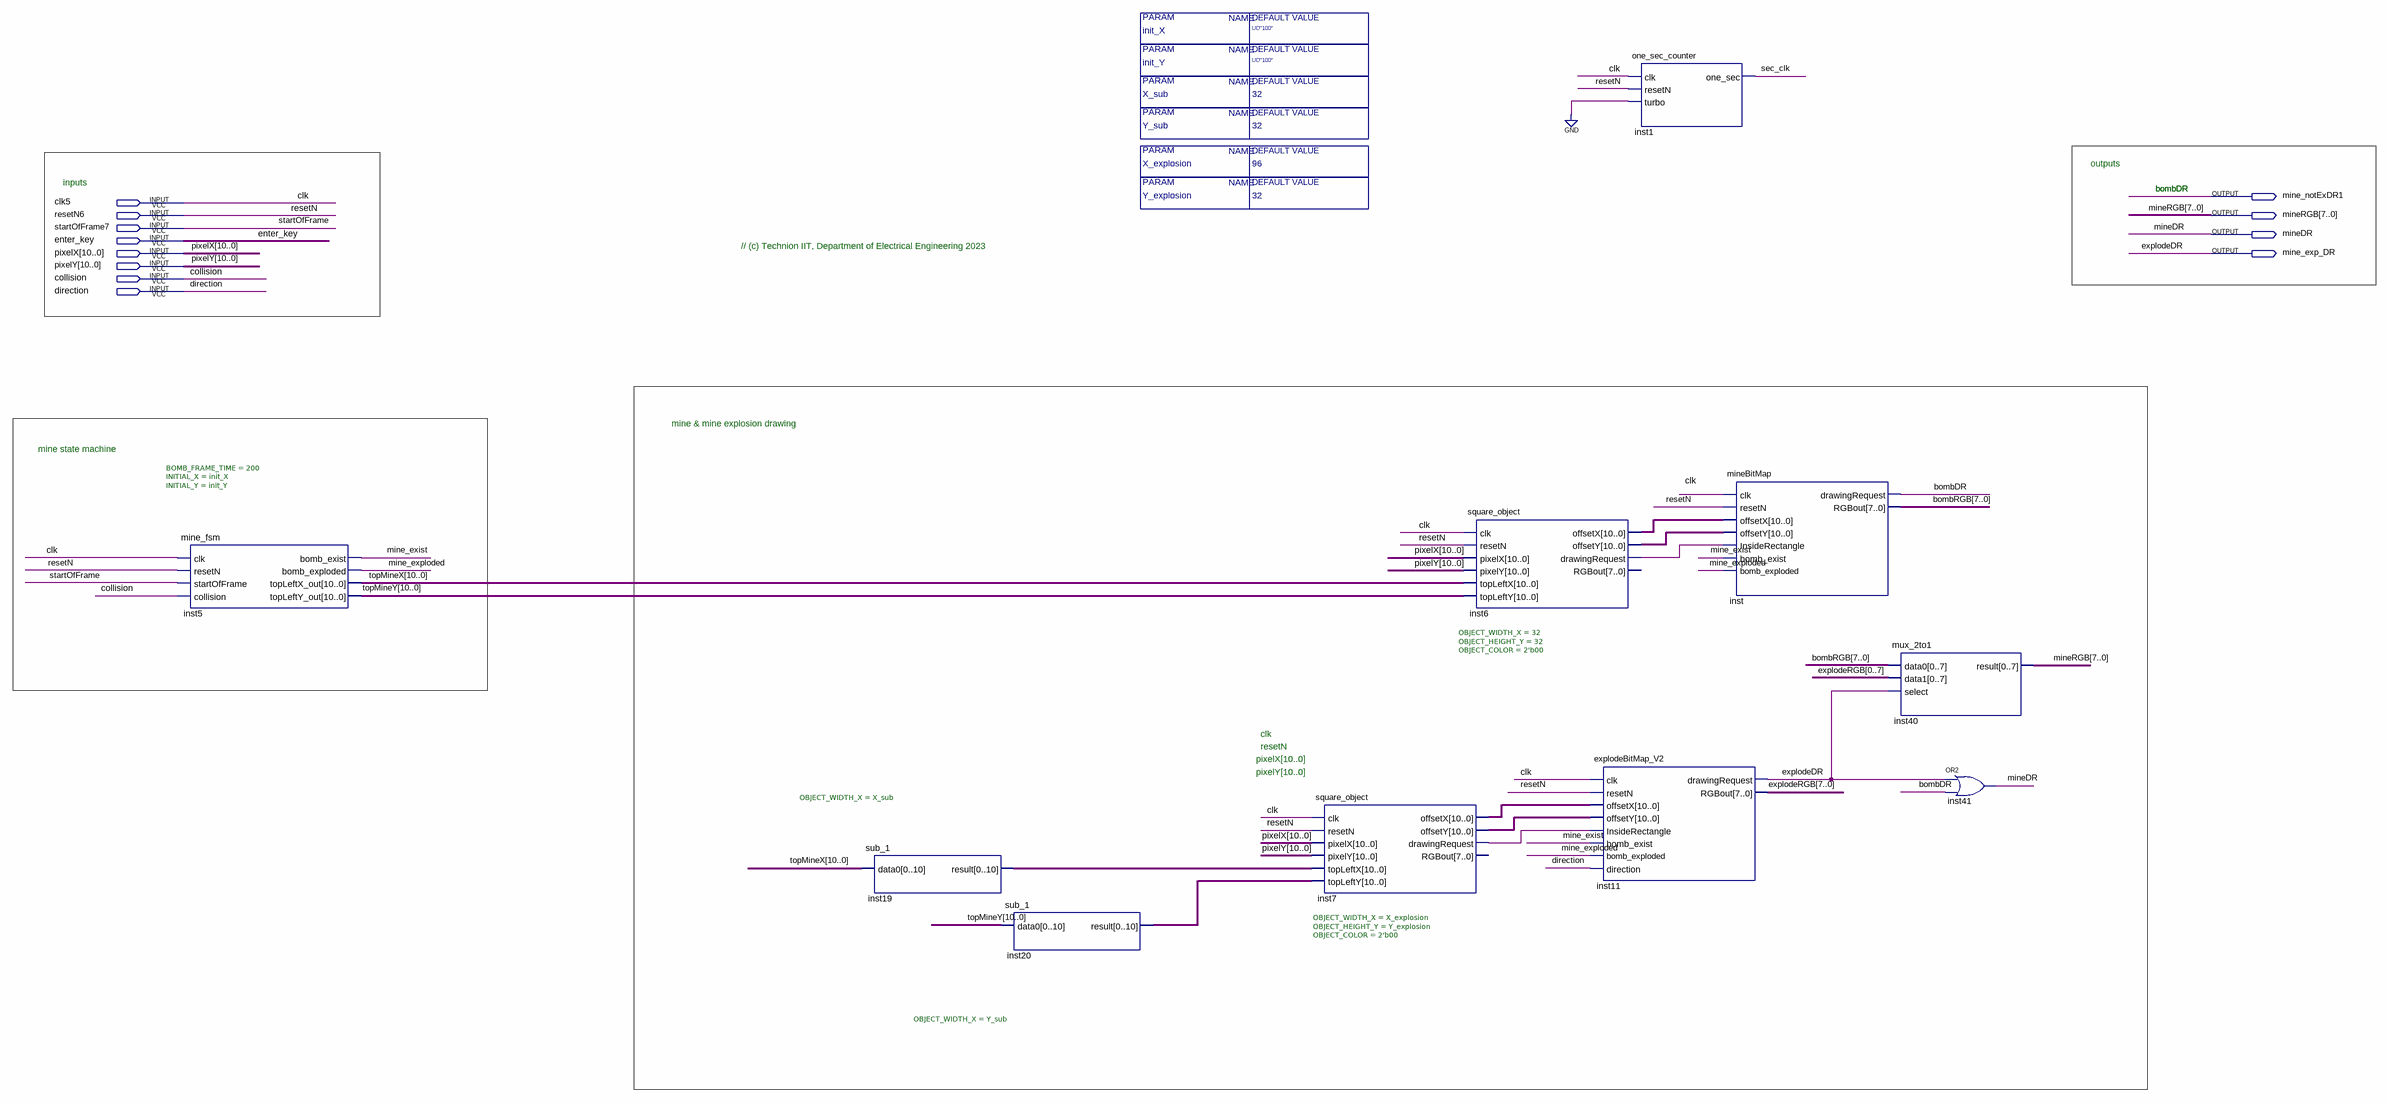
[diagram p0: schematic sheet]
// Quartus schematic mine_Block_T.bdf as structural Verilog: 10 symbols, 12 pins
module mine_Block_T #(parameter init_X = "UD\"100\"", parameter init_Y = "UD\"100\"", parameter X_explosion = 96, parameter Y_explosion = 32, parameter X_sub = 32, parameter Y_sub = 32) (
  input  clk5,
  input  resetN6,
  input  startOfFrame7,
  input  enter_key,
  input  [10:0] pixelX,
  input  [10:0] pixelY,
  input  collision,
  input  direction,
  output mine_notExDR1,
  output [7:0] mineRGB,
  output mineDR,
  output mine_exp_DR
);

  wire inst6_drawingrequest, inst7_drawingrequest, mine_exist, mine_exploded, sec_clk;
  wire [7:0] bombRGB, explodeRGB;
  wire [10:0] inst6_offsetx, inst6_offsety, inst7_offsetx, inst7_offsety, inst19_result, inst20_result,
       topMineX, topMineY;

  mine_fsm #(.BOMB_FRAME_TIME(200), .INITIAL_X(init_X), .INITIAL_Y(init_Y)) inst5 (
    .clk(clk5), .resetN(resetN6), .startOfFrame(startOfFrame7), .collision(collision),
    .bomb_exist(mine_exist), .bomb_exploded(mine_exploded), .topLeftX_out(topMineX), .topLeftY_out(topMineY));
  sub_1 #(.OBJECT_WIDTH_X(X_sub)) inst19 (.data0(topMineX), .result(inst19_result));
  sub_1 #(.OBJECT_WIDTH_X(Y_sub)) inst20 (.data0(topMineY), .result(inst20_result));
  square_object #(.OBJECT_WIDTH_X(X_explosion), .OBJECT_HEIGHT_Y(Y_explosion), .OBJECT_COLOR(2'b00)) inst7 (
    .clk(clk5), .resetN(resetN6), .pixelX(pixelX), .pixelY(pixelY), .topLeftX(inst19_result),
    .topLeftY(inst20_result), .offsetX(inst7_offsetx), .offsetY(inst7_offsety),
    .drawingRequest(inst7_drawingrequest));  // open: RGBout
  square_object #(.OBJECT_WIDTH_X(32), .OBJECT_HEIGHT_Y(32), .OBJECT_COLOR(2'b00)) inst6 (
    .clk(clk5), .resetN(resetN6), .pixelX(pixelX), .pixelY(pixelY), .topLeftX(topMineX), .topLeftY(topMineY),
    .offsetX(inst6_offsetx), .offsetY(inst6_offsety), .drawingRequest(inst6_drawingrequest));  // open: RGBout
  explodeBitMap_V2 inst11 (
    .clk(clk5), .resetN(resetN6), .offsetX(inst7_offsetx), .offsetY(inst7_offsety),
    .InsideRectangle(inst7_drawingrequest), .bomb_exist(mine_exist), .bomb_exploded(mine_exploded),
    .direction(direction), .drawingRequest(mine_exp_DR), .RGBout(explodeRGB));
  one_sec_counter inst1 (.clk(clk5), .resetN(resetN6), .turbo(1'b0), .one_sec(sec_clk));
  mineBitMap inst (
    .clk(clk5), .resetN(resetN6), .offsetX(inst6_offsetx), .offsetY(inst6_offsety),
    .InsideRectangle(inst6_drawingrequest), .bomb_exist(mine_exist), .bomb_exploded(mine_exploded),
    .drawingRequest(mine_notExDR1), .RGBout(bombRGB));
  mux_2to1 inst40 (
    .data0(bombRGB),
    .data1({explodeRGB[0], explodeRGB[1], explodeRGB[2], explodeRGB[3], explodeRGB[4], explodeRGB[5], explodeRGB[6], explodeRGB[7]}),
    .select(mine_exp_DR), .result(mineRGB));
  or inst41 (mineDR, mine_exp_DR, mine_notExDR1);

  // Other names for the same wires on the sheet: bombDR = mine_notExDR1; clk = clk5; explodeDR = mine_exp_DR;
  //   resetN = resetN6; startOfFrame = startOfFrame7

  // Notes on the sheet:
  //   outputs
  //   inputs
  //   bombDR
  //   bombDR
  //   // (c) Technion IIT, Department of Electrical Engineering 2023
  //   mine & mine explosion drawing
  //   mine state machine
  //   clk
  //   resetN
  //   pixelX[10..0]
  //   pixelY[10..0]
endmodule
